# EAGLE design HIJACK_LQPF_A (EAGLE 5.10)
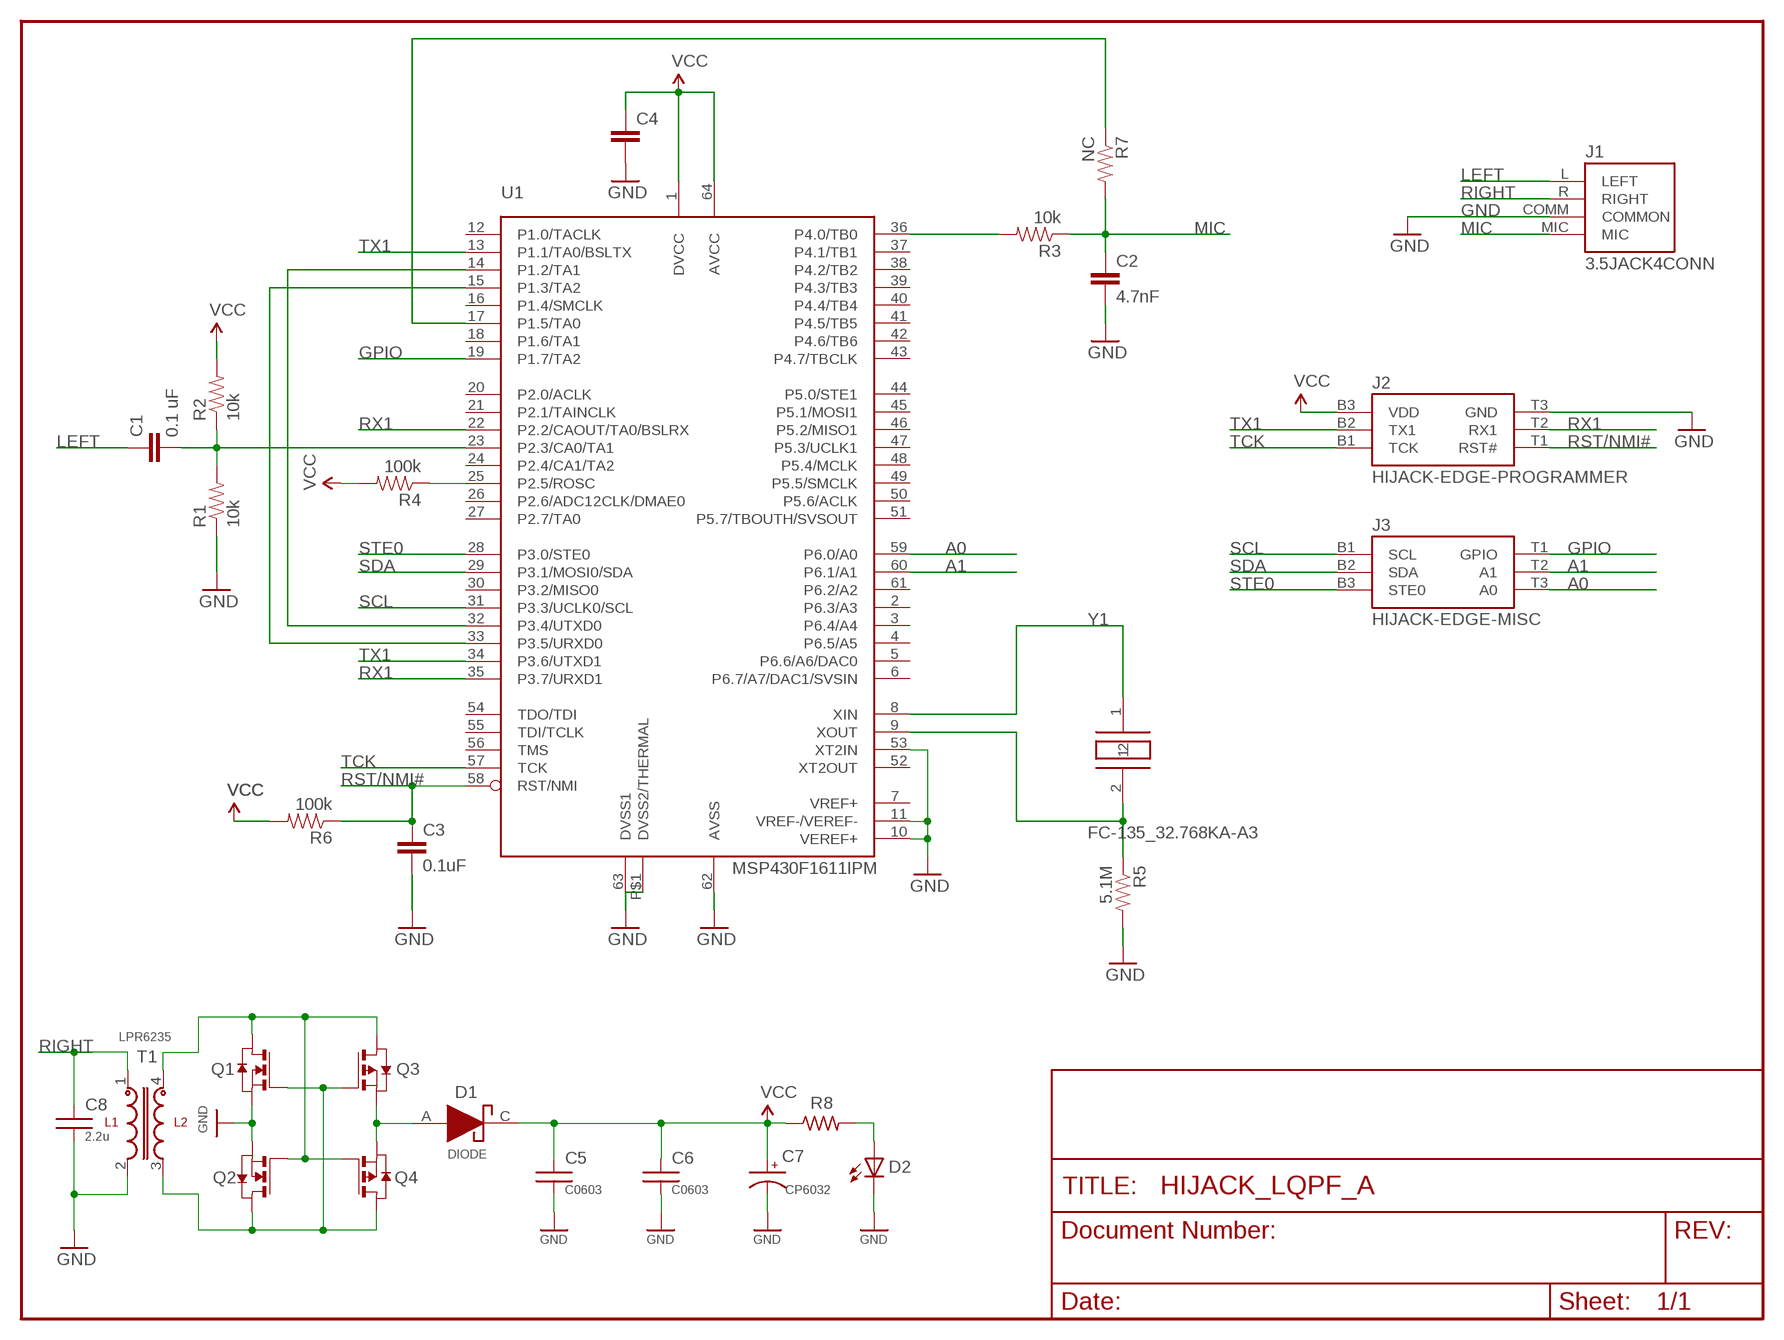
[diagram p0: schematic, sheet 1]

## Parts
C1  0.1 uF  CAP0603-CAP  [0603-CAP]
C2  4.7nF  CAP0603-CAP  [0603-CAP]
C3  0.1uF  CAP0603-CAP  [0603-CAP]
C4  CAP0603-CAP  [0603-CAP]
C5  C0603  [C0603]
C6  C0603  [C0603]
C7  CP6032  [CT6032]
C8  2.2u  C0603  [C0603]
D1  DIODE  [MINIMELF]
D2  LED0603  [LED-0603]
J1  3.5JACK4CONN  [PLUGBOARDCONNECTOR]
J2  HIJACK-EDGE-PROGRAMMER  [6-PIN-EDGE-CONNECTOR]
J3  HIJACK-EDGE-MISC  [6-PIN-EDGE-CONNECTOR]
Q1  NMOSSOT23  [SOT-23]
Q2  NMOSSOT23  [SOT-23]
Q3  PMOSSOT23  [SOT-23]
Q4  PMOSSOT23  [SOT-23]
R1  10k  RESISTOR0603-RES  [0603-RES]
R2  10k  RESISTOR0603-RES  [0603-RES]
R3  10k  RESISTOR0603-RES  [0603-RES]
R4  100k  RESISTOR0603-RES  [0603-RES]
R5  5.1M  RESISTOR0603-RES  [0603-RES]
R6  100k  RESISTOR0603-RES  [0603-RES]
R7  NC  RESISTOR0603-RES  [0603-RES]
R8  R-US_R0603  [R0603]
T1  LPR6235  [LPR6235]
U1  MSP430F1611IPM  [PM/PAG64]
Y1  FC-135_32.768KA-A3  [FC-135]

## Nets
A0: J3.T3(A0) U1.59(P6.0/A0)
A1: J3.T2(A1) U1.60(P6.1/A1)
GND: C2.2 C3.2 C4.2 C5.2 C6.2 C7.- C8.2 D2.C J1.COMM(COMMON) J2.T3(GND) Q1.2(S) Q2.2(S) R1.1 R5.2 T1.2 U1.10(VEREF+) U1.11(VREF-/VEREF-) U1.53(XT2IN) U1.62(AVSS) U1.63(DVSS1) U1.P$1(DVSS2/THERMAL)
GPIO: J3.T1(GPIO) U1.19(P1.7/TA2)
LEFT: C1.1 J1.L(LEFT)
MIC: C2.1 J1.MIC R3.1 R7.2
N$1: C1.2 R1.2 R2.1 U1.23(P2.3/CA0/TA1)
N$2: U1.14(P1.2/TA1) U1.32(P3.4/UTXD0)
N$3: U1.15(P1.3/TA2) U1.33(P3.5/URXD0)
N$4: R4.1 U1.25(P2.5/ROSC)
N$5: U1.8(XIN) Y1.1
N$6: R7.1 U1.17(P1.5/TA0)
N$7: R3.2 U1.36(P4.0/TB0)
N$8: Q1.1(D) Q2.3(G) Q3.1(D) Q4.3(G) T1.4
N$9: Q1.3(G) Q2.1(D) Q3.3(G) Q4.1(D) T1.3
N$10: R5.1 U1.9(XOUT) Y1.2
N$11: D2.A R8.2
N$17: D1.A Q3.2(S) Q4.2(S)
RIGHT: C8.1 J1.R(RIGHT) T1.1
RST/NMI#: C3.1 J2.T1(RST#) R6.1 U1.58(RST/NMI)
RX1: J2.T2(RX1) U1.22(P2.2/CAOUT/TA0/BSLRX) U1.35(P3.7/URXD1)
SCL: J3.B1(SCL) U1.31(P3.3/UCLK0/SCL)
SDA: J3.B2(SDA) U1.29(P3.1/MOSI0/SDA)
STE0: J3.B3(STE0) U1.28(P3.0/STE0)
TCK: J2.B1(TCK) U1.57(TCK)
TX1: J2.B2(TX1) U1.13(P1.1/TA0/BSLTX) U1.34(P3.6/UTXD1)
VCC: C4.1 C5.1 C6.1 C7.+ D1.C J2.B3(VDD) R2.2 R4.2 R6.2 R8.1 U1.1(DVCC) U1.64(AVCC)
Unconnected: U1.2(P6.3/A3) U1.3(P6.4/A4) U1.4(P6.5/A5) U1.5(P6.6/A6/DAC0) U1.6(P6.7/A7/DAC1/SVSIN) U1.7(VREF+) U1.12(P1.0/TACLK) U1.16(P1.4/SMCLK) U1.18(P1.6/TA1) U1.20(P2.0/ACLK) U1.21(P2.1/TAINCLK) U1.24(P2.4/CA1/TA2) U1.26(P2.6/ADC12CLK/DMAE0) U1.27(P2.7/TA0) U1.30(P3.2/MISO0) U1.37(P4.1/TB1) U1.38(P4.2/TB2) U1.39(P4.3/TB3) U1.40(P4.4/TB4) U1.41(P4.5/TB5) U1.42(P4.6/TB6) U1.43(P4.7/TBCLK) U1.44(P5.0/STE1) U1.45(P5.1/MOSI1) U1.46(P5.2/MISO1) U1.47(P5.3/UCLK1) U1.48(P5.4/MCLK) U1.49(P5.5/SMCLK) U1.50(P5.6/ACLK) U1.51(P5.7/TBOUTH/SVSOUT) U1.52(XT2OUT) U1.54(TDO/TDI) U1.55(TDI/TCLK) U1.56(TMS) U1.61(P6.2/A2)

## Library data of the parts
C1-C4 = SparkFun:CAP: Capacitor Standard 0603 ceramic capacitor, and 0.1" leaded capacitor.
C5 C6 C8 = umich:C
C7 = umich:CP
D1 = umich:DIODE
D2 = umich:LED: LEDs Standard schematic elements and footprints for 5mm, 3mm, 1206, and 0603 sized LEDs. 5mm - Spark Fun Electronics SKU : COM-00529 (and others)
J1 = Thomas:3.5JACK4CONN
J2 = Thomas:HIJACK-EDGE-PROGRAMMER
J3 = Thomas:HIJACK-EDGE-MISC
Q1 Q2 = zetex:NMOSSOT23: MOS FET
Q3 Q4 = zetex:PMOSSOT23: MOS FET
R1-R7 = SparkFun:RESISTOR: Resistor Basic schematic elements and footprints for 0603, 1206, and PTH 1/10th watt (small) resistors.
R8 = rcl:R-US_: RESISTOR, American symbol
T1 = umich:LPR6235
U1 = Thomas:MSP430F1611
Y1 = berkeley-epic:FC-135_32.768KA-A3

## Board
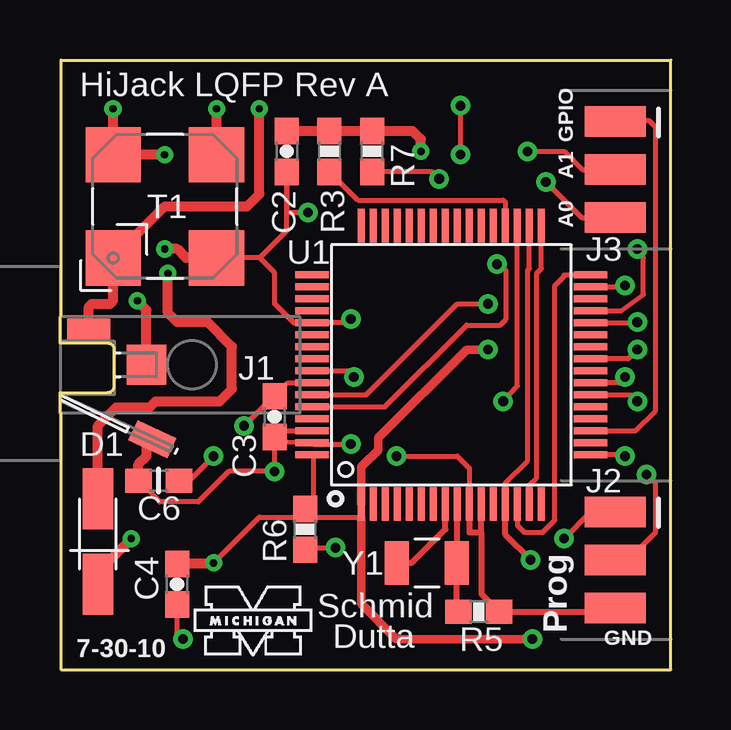
[diagram p1: board, top side]
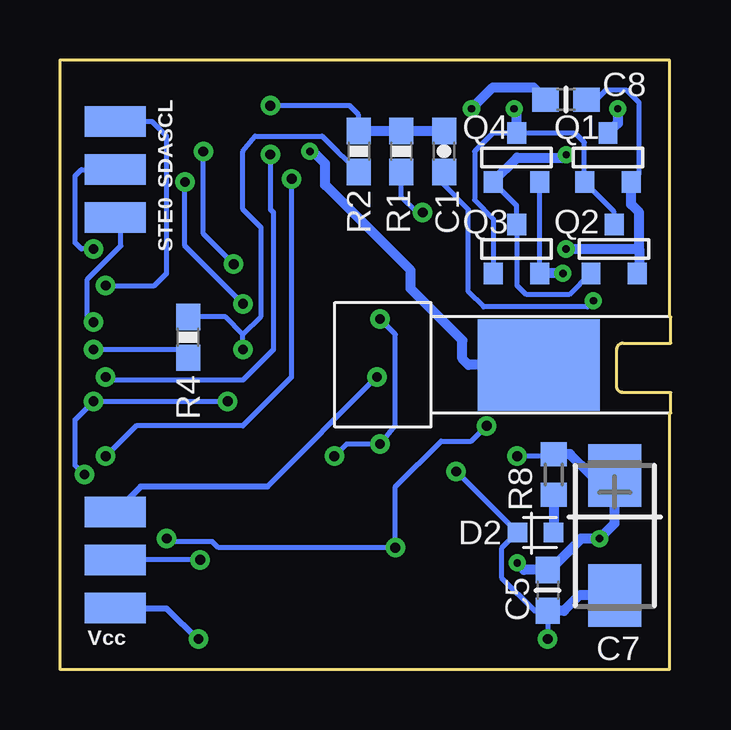
[diagram p2: board, bottom side, seen from below]

Size 25.45 x 25.4 mm. Coordinates in mm from the lower left corner, seen from the top.
Outline: 0.05,10.67 0.05,0 25.45,0 25.45,25.4 0.05,25.4 0.05,14.73
Copper layers (1*16): Top 0.035mm / dielectric 1.5mm / Bottom 0.035mm
Design rules "default *": minimum track width 8mil, minimum drill 12mil, track to track 6mil, track to pad 6mil, pad to pad 6mil, via to via 6mil, smd to smd 6mil, copper to edge 15mil, drill to drill 8mil, minimum pad ring 8mil, minimum via ring 8mil, stop-mask expansion 4mil, vias tented up to drill 16mil, thermal gap 10mil

### Footprints (pad centres in the part's own frame; a part is rotated, then mirrored left to right if it is on the bottom)
0603-CAP = smd 1.1 x 1: 1 -0.85,0; 2 0.85,0
C0603 = smd 1.1 x 1: 1 -0.85,0; 2 0.85,0
CT6032 = smd 2.6 x 2.2: + -2.5,0; - 2.5,0
MINIMELF = smd 2.54 x 1.27: A -1.778,0; C 1.778,0
LED-0603 = smd 0.8 x 0.8: A 0,-0.75; C 0,0.75
PLUGBOARDCONNECTOR = smd 1.778 x 0.914 rotated 155: COMM 3.799,-3.103 | smd 1.651 x 1.651: L 3.55,0 | smd 5.08 x 3.81 bottom: MIC 5.45,0 | smd 1.778 x 0.914: R 1.15,1.452
6-PIN-EDGE-CONNECTOR = smd 2.54 x 1.27 bottom: B1 1.5,2; B2 1.5,0; B3 1.5,-2 | smd 2.54 x 1.27: T1 1.5,2; T2 1.5,0; T3 1.5,-2
SOT-23 = smd 0.787 x 0.889: 1 0.025,-1.016; 2 -0.94,1.016; 3 0.991,1.016
0603-RES = smd 1.1 x 1: 1 -0.85,0; 2 0.85,0
R0603 = smd 1 x 1.1: 1 -0.85,0; 2 0.85,0
LPR6235 = smd 2.3 x 2.3: 1 -2.15,2.15; 2 -2.15,-2.15; 3 2.15,-2.15; 4 2.15,2.15
PM/PAG64 = smd 1.4 x 0.3: 1 -5.8,3.75; 2 -5.8,3.25; 3 -5.8,2.75; 4 -5.8,2.25; 5 -5.8,1.75; 6 -5.8,1.25; 7 -5.8,0.75; 8 -5.8,0.25; 9 -5.8,-0.25; 10 -5.8,-0.75; 11 -5.8,-1.25; 12 -5.8,-1.75; 13 -5.8,-2.25; 14 -5.8,-2.75; 15 -5.8,-3.25; 16 -5.8,-3.75; 33 5.8,-3.75; 34 5.8,-3.25; 35 5.8,-2.75; 36 5.8,-2.25; 37 5.8,-1.75; 38 5.8,-1.25; 39 5.8,-0.75; 40 5.8,-0.25; 41 5.8,0.25; 42 5.8,0.75; 43 5.8,1.25; 44 5.8,1.75; 45 5.8,2.25; 46 5.8,2.75; 47 5.8,3.25; 48 5.8,3.75 | smd 0.3 x 1.4: 17 -3.75,-5.8; 18 -3.25,-5.8; 19 -2.75,-5.8; 20 -2.25,-5.8; 21 -1.75,-5.8; 22 -1.25,-5.8; 23 -0.75,-5.8; 24 -0.25,-5.8; 25 0.25,-5.8; 26 0.75,-5.8; 27 1.25,-5.8; 28 1.75,-5.8; 29 2.25,-5.8; 30 2.75,-5.8; 31 3.25,-5.8; 32 3.75,-5.8; 49 3.75,5.8; 50 3.25,5.8; 51 2.75,5.8; 52 2.25,5.8; 53 1.75,5.8; 54 1.25,5.8; 55 0.75,5.8; 56 0.25,5.8; 57 -0.25,5.8; 58 -0.75,5.8; 59 -1.25,5.8; 60 -1.75,5.8; 61 -2.25,5.8; 62 -2.75,5.8; 63 -3.25,5.8; 64 -3.75,5.8 | smd 0.152 x 0.305: P$1 -3.175,6.985
FC-135 = smd 1 x 1.8: 1 -1.25,0; 2 1.25,0

### Placement (x,y rotation side)
C1  9.45,21.59 90 bottom
C2  9.45,21.59 270 top
C3  8.94,10.54 270 top
C4  4.88,3.56 270 top
C5  5.13,3.3 270 bottom
C6  4.11,7.87 180 top
C7  2.34,5.59 270 bottom
C8  4.37,23.75 0 bottom
D1  1.57,5.33 270 top
D2  5.64,5.71 90 bottom
J1  0.05,12.7 0 top
J2  21.64,4.57 0 top
J3  21.64,20.83 0 top
Q1  2.59,21.34 180 bottom
Q2  2.34,17.53 180 bottom
Q3  6.4,17.53 180 bottom
Q4  6.4,21.34 180 bottom
R1  11.23,21.59 90 bottom
R2  13,21.59 270 bottom
R3  11.23,21.59 270 top
R4  20.12,13.84 90 bottom
R5  17.45,2.41 0 top
R6  10.21,5.84 90 top
R7  13,21.59 90 top
R8  4.88,8.13 270 bottom
T1  4.37,19.3 90 top
U1  16.31,12.7 90 top
U$2  [UMICH]  5.51,0.38 0 top
Y1  15.29,4.45 0 top

### Tracks (layer width: path | path; a pad name or v marks a point on that pad's centre or on a via)
A0  (via drill 0.41)
  Top 0.203: U1.59 12.77,11.45 16.56,15.24 v17.83,15.24 | v20.24,20.32 21.73,18.83 J3.T3
  Bottom 0.203: v17.83,15.24 20.24,17.65 v20.24,20.32
A1  (via drill 0.41)
  Top 0.203: U1.60 13.54,10.95 16.94,14.35 18.34,14.35 18.59,14.61 18.59,16.64 v18.21,16.89 | v19.48,21.59 21,21.59 21.77,20.83 J3.T2
  Bottom 0.203: v18.21,16.89 19.48,18.16 v19.48,21.59
GND  (via drill 0.3, 0.41)
  Top 0.203: C3.2 v8.94,8.26 7.04,8.26 5.76,6.99 4.15,6.99 C6.2 | C3.2 9.11,9.53 U1.P$1 9.07,9.49 U1.63 10.58,9.4 v12.12,9.4 | 8.31,17.15 9.45,18.29 C2.2 9.45,19.05 v10.34,19.05 | 8.31,17.15 T1.2 | U1.62 9.2,9.95 C3.2 | 8.31,17.15 8.94,16.53 8.94,15.24 9.73,14.45 U1.53 12.12,14.45 v12.12,14.61 | v5.13,1.27 4.88,1.52 C4.2 | v14.02,8.89 16.56,8.89 17.06,8.39 U1.10
  Top 0.254: 17.56,5.71 17.56,3.16 R5.2 22.98,2.41 J2.T3 | 17.56,5.71 U1.11 | U1.10 17.06,5.71 17.56,5.71
  Top 0.406: T1.2 5.25,17.15 4.88,17.53 v4.37,17.53 | C6.2 3.26,8.55 3.61,8.89 3.61,9.35 J1.COMM | C4.2 4.92,2.67
  Bottom 0.203: 1.32,16.51 Q2.2 | v8.94,8.26 D2.C 6.4,5.84 6.39,5.83 D2.C 7.04,5.07 7.04,3.81 5.68,2.45 C5.2 v5.13,1.27 | v10.34,19.05 10.59,19.05 11.23,19.68 R1.1 | v14.02,8.89 13.51,9.4 v12.12,9.4 11.48,10.16 11.48,13.97 v12.12,14.61 | Q1.2 1.32,20.65 1.32,23.62 1.83,24.13 2.72,24.13 3.1,23.75 C8.2
  Bottom 0.406: Q1.2 1.65,19.38 1.32,19.05 1.32,17.53 | 1.32,17.53 1.32,16.51 | C5.2 4.46,2.45 3.82,3.09 C7.- | Q2.2 1.4,16.59 | v4.37,17.53 1.32,17.53
GPIO
  Top 0.203: J3.T1 23.16,22.86 24.56,22.86 24.82,22.61 24.82,10.79 23.97,9.95 U1.19
LEFT  (via drill 0.3)
  Top 0.406: J1.L 3.6,14.99 v3.22,15.37
  Bottom 0.203: v3.22,15.37 3.48,15.11 7.8,15.11 8.43,15.75 8.43,19.18 9.45,20.19 C1.1
MIC  (via drill 0.3)
  Top 0.406: C2.1 R3.1 R7.2 14.69,22.44 15.04,22.1 v15.04,21.59
  Bottom 0.406: J1.MIC 8.43,12.7 8.69,12.95 8.69,13.72 10.85,15.88 10.85,16.64 14.4,20.19 14.4,21.08 14.91,21.59 v15.04,21.59
N$1  (via drill 0.41)
  Top 0.203: 22.14,11.95 U1.23 23.3,11.95 v23.55,12.19 | v16.69,23.5 v16.69,21.46
  Bottom 0.203: v23.55,12.19 23.42,12.06 17.83,12.06 16.56,13.34 16.56,19.05 16.69,19.18 v16.69,21.46 | v16.69,23.5 13.39,23.5 13,23.11 R2.1
  Bottom 0.406: C1.2 R1.2 R2.1
N$2
  Top 0.203: U1.32 21,16.45 21,16.38 20.62,16 20.62,6.22 20.12,5.71 19.35,5.71 19.06,6.01 U1.14
N$3
  Top 0.203: U1.33 20.06,16.7 19.86,16.51 19.86,8 19.56,7.7 U1.15
N$4  (via drill 0.41)
  Top 0.203: v24.05,13.34 23.68,12.95 U1.25
  Bottom 0.203: 20.41,12.7 R4.1 20.46,13.34 v24.05,13.34
N$5
  Top 0.254: U1.8 16.06,5.85 14.66,4.45 Y1.1
N$6  (via drill 0.41, 0.41 pad 0.79)
  Top 0.203: v15.8,20.45 15.51,20.74 R7.1 | U1.17 23.55,8.95 v23.55,8.89
  Bottom 0.203: v23.55,8.89 22.28,10.16 17.83,10.16 15.8,12.19 v15.8,20.45
N$7
  Top 0.203: R3.2 12.41,19.56 18.46,19.56 18.56,19.47 U1.36
N$8  (via drill 0.3)
  Top 0.406: v2.21,23.37 2.22,23.23 T1.4 v4.36,21.45
  Bottom 0.203: Q4.3 7.42,20.32 6.42,19.33 Q3.1 6.4,18.54 6.4,16 6.02,15.62 4.24,15.62 3.35,16.51 Q2.3
  Bottom 0.406: v2.21,23.37 2.21,22.76 Q1.1 | Q4.3 7.39,20.34 6.4,21.34 4.5,21.34 v4.36,21.45
N$9  (via drill 0.3)
  Top 0.406: T1.3 6.52,23.23 v6.53,23.37
  Bottom 0.203: 3.61,20.32 Q1.3 | Q2.1 2.36,19.07 3.61,20.32 | Q3.3 7.39,18.77 8.18,19.56 8.18,21.59 7.42,22.35 Q4.1 3.99,22.35 3.61,21.97 3.61,20.32
  Bottom 0.406: Q4.1 6.42,23.14 v6.53,23.37
N$10
  Top 0.254: U1.9 16.56,4.45 Y1.2 16.54,2.41 R5.1
N$11
  Bottom 0.406: D2.A 4.89,5.83 4.88,6.35 R8.2
N$17  (via drill 0.3)
  Top 0.406: D1.A 1.57,10.16 2.34,10.92 3.73,10.92 3.99,11.18 6.65,11.18 7.16,11.68 7.16,13.46 6.15,14.48 4.88,14.48 4.5,14.86 v4.5,16.51
  Bottom 0.203: Q3.2 Q4.2 5.46,20.37 5.38,20.45
  Bottom 0.406: v4.5,16.51 Q3.2
RIGHT  (via drill 0.3)
  Top 0.406: J1.R 1.2,15.12 1.32,15.24 2.08,15.24 2.22,15.38 T1.1 4.37,19.3 7.8,19.3 8.31,19.81 v8.31,23.37
  Bottom 0.406: v8.31,23.37 7.42,24.26 5.73,24.26 C8.1
RST/NMI#  (via drill 0.41, 0.41 pad 0.79)
  Top 0.203: 11.24,11.95 U1.58 9.5,11.95 C3.1 8.9,11.39 v7.67,10.16 | v11.48,5.08 10.3,5.08 R6.1 | 23.11,6.6 J2.T1 22.12,6.57 v21,5.46
  Bottom 0.203: v7.67,10.16 8.31,9.53 9.58,9.53 11.48,7.62 v11.48,5.08 18.85,5.08 19.1,5.33 20.88,5.33 v21,5.46 20.97,5.43
RX1  (via drill 0.41, 0.41 pad 0.79)
  Top 0.203: U1.22 22.11,11.43 23.8,11.43 v24.05,11.18 | U1.35 19.06,11.81 v18.46,11.18 | v24.43,8.13 24.82,7.75 24.82,5.71 24.18,5.08 23.65,5.08 J2.T2
  Bottom 0.203: v18.46,11.18 v24.05,11.18 24.82,10.41 24.82,8.51 v24.43,8.13
SCL  (via drill 0.41)
  Top 0.203: v23.55,16 23.47,15.95 U1.31
  Bottom 0.203: J3.B1 21.61,22.83 21,22.23 21,16.51 21.51,16 v23.55,16
SDA  (via drill 0.41)
  Top 0.203: U1.29 23.38,14.95 24.31,15.62 24.31,17.14 v24.05,17.53
  Bottom 0.203: v24.05,17.53 24.56,17.53 24.82,17.78 24.82,20.57 24.56,20.83 J3.B2
STE0  (via drill 0.41)
  Top 0.203: v24.05,14.48 24.03,14.45 U1.28
  Bottom 0.203: J3.B3 22.91,18.6 22.91,17.65 24.31,16.26 24.31,14.73 v24.05,14.48
TCK  (via drill 0.41)
  Top 0.203: v12.24,12.19 11.98,12.45 U1.57
  Bottom 0.203: v12.24,12.19 16.81,7.62
  Bottom 0.254: 16.81,7.62 22.09,7.62 J2.B1
TX1  (via drill 0.41 pad 0.79)
  Top 0.203: U1.34 19.56,16.71 19.48,16.64 19.48,8.71 18.56,7.78 U1.13
  Top 0.254: v19.61,4.57 18.56,5.62 U1.13
  Bottom 0.203: v19.61,4.57 J2.B2
VCC  (via drill 0.3, 0.41, 0.41 pad 0.79)
  Top 0.203: C4.1 C5.1 | 10.21,6.35 R6.2 10.57,7.05 10.57,8.89 U1.64 | 10.21,6.35 12.56,6.35 | 10.21,6.35 8.31,6.35 v6.4,4.45 | v6.4,8.89 5.38,7.87 C6.1
  Top 0.254: 12.56,6.35 U1.1
  Top 0.356: v19.68,1.27 14.02,1.27 12.56,2.73 12.56,6.35 | U1.1 12.56,8.45 12.62,8.51 13.26,9.14 13.26,9.65 16.94,13.34 v17.83,13.34
  Top 0.406: C4.1 6.27,4.41 v6.4,4.45 | v2.97,5.46 1.57,4.06 D1.C
  Bottom 0.203: R2.2 13.09,20.83 13.89,21.59 14.53,22.23 17.32,22.23 17.83,21.59 17.83,19.18 17.07,18.41 17.07,14.73 17.83,13.97 | 19.65,14.69 R4.2 18.55,14.69 17.83,13.97 | v17.83,13.34 17.83,13.97 | R8.1 4.96,8.89 v6.4,8.89
  Bottom 0.254: v19.68,1.27 19.68,1.21 21,2.54 23.16,2.54 J2.B3
  Bottom 0.406: R8.1 4.2,8.98 3.31,8.09 C7.+ 2.34,6.1 v2.97,5.46 3.73,5.46 5,4.19 C5.1 6.11,4.15 v6.4,4.45

### Text on the board
tPlace: HiJack LQFP Rev A | Schmid | Dutta
tNames: GPIO | A1 | A0 | Prog | 7-30-10 | GND
bNames: SCL | SDA | STE0 | Vcc